# Altium schematic sheet 101_GridPosMainHub.SchDoc: Grid Position Main Hub
size A2; Organization: Greenfield Tech Solutions; Address1: Molendreef 33; Address2: Ossendrecht; Address3: 4641CS; Address4: The Netherlands; SheetNumber: 2; SheetTotal: 4
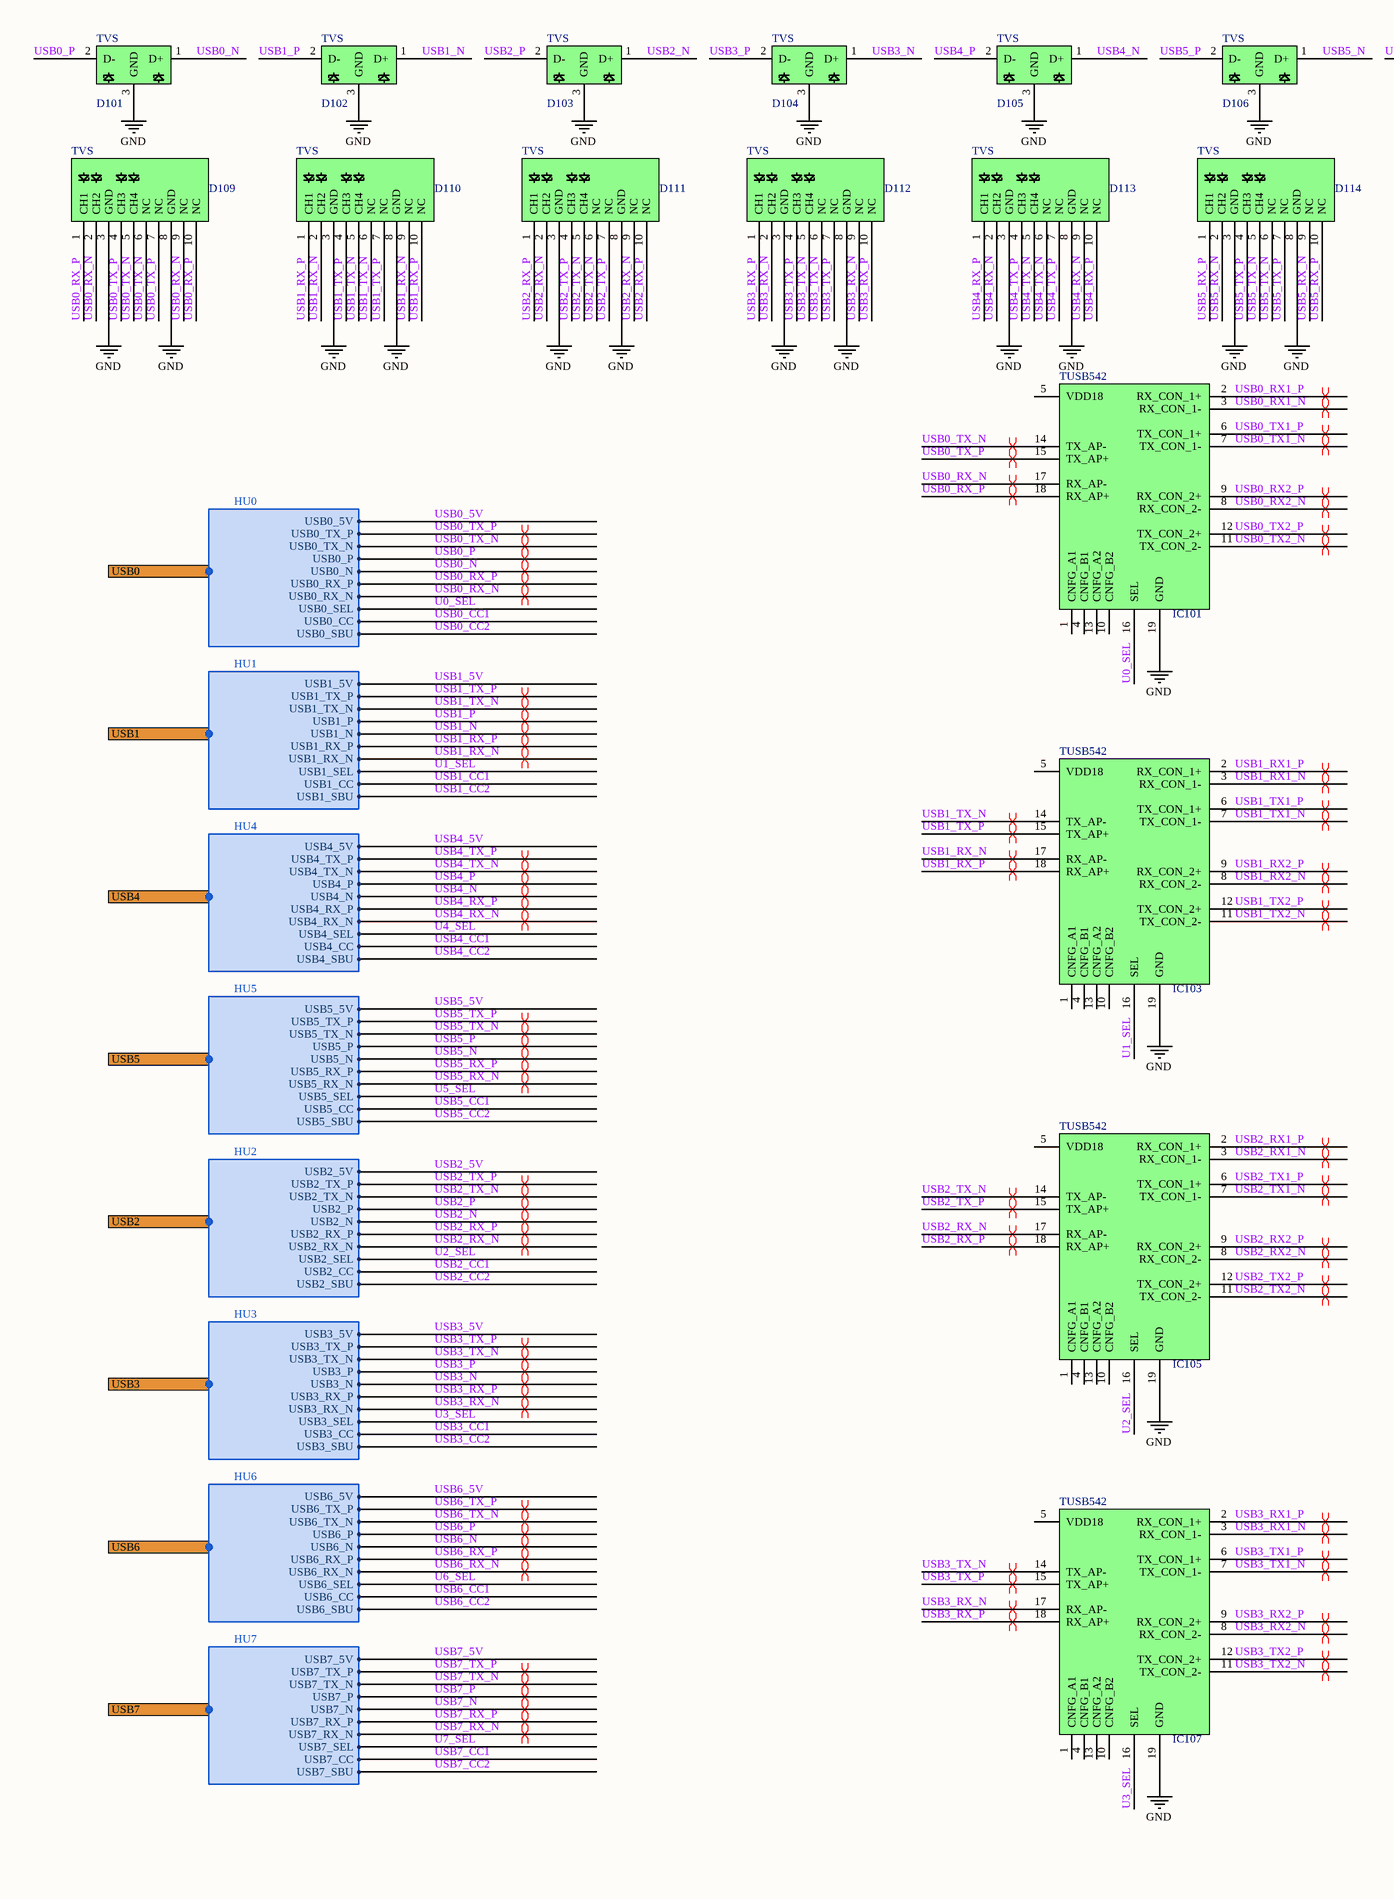
[diagram p0: 101_GridPosMainHub.SchDoc, left]
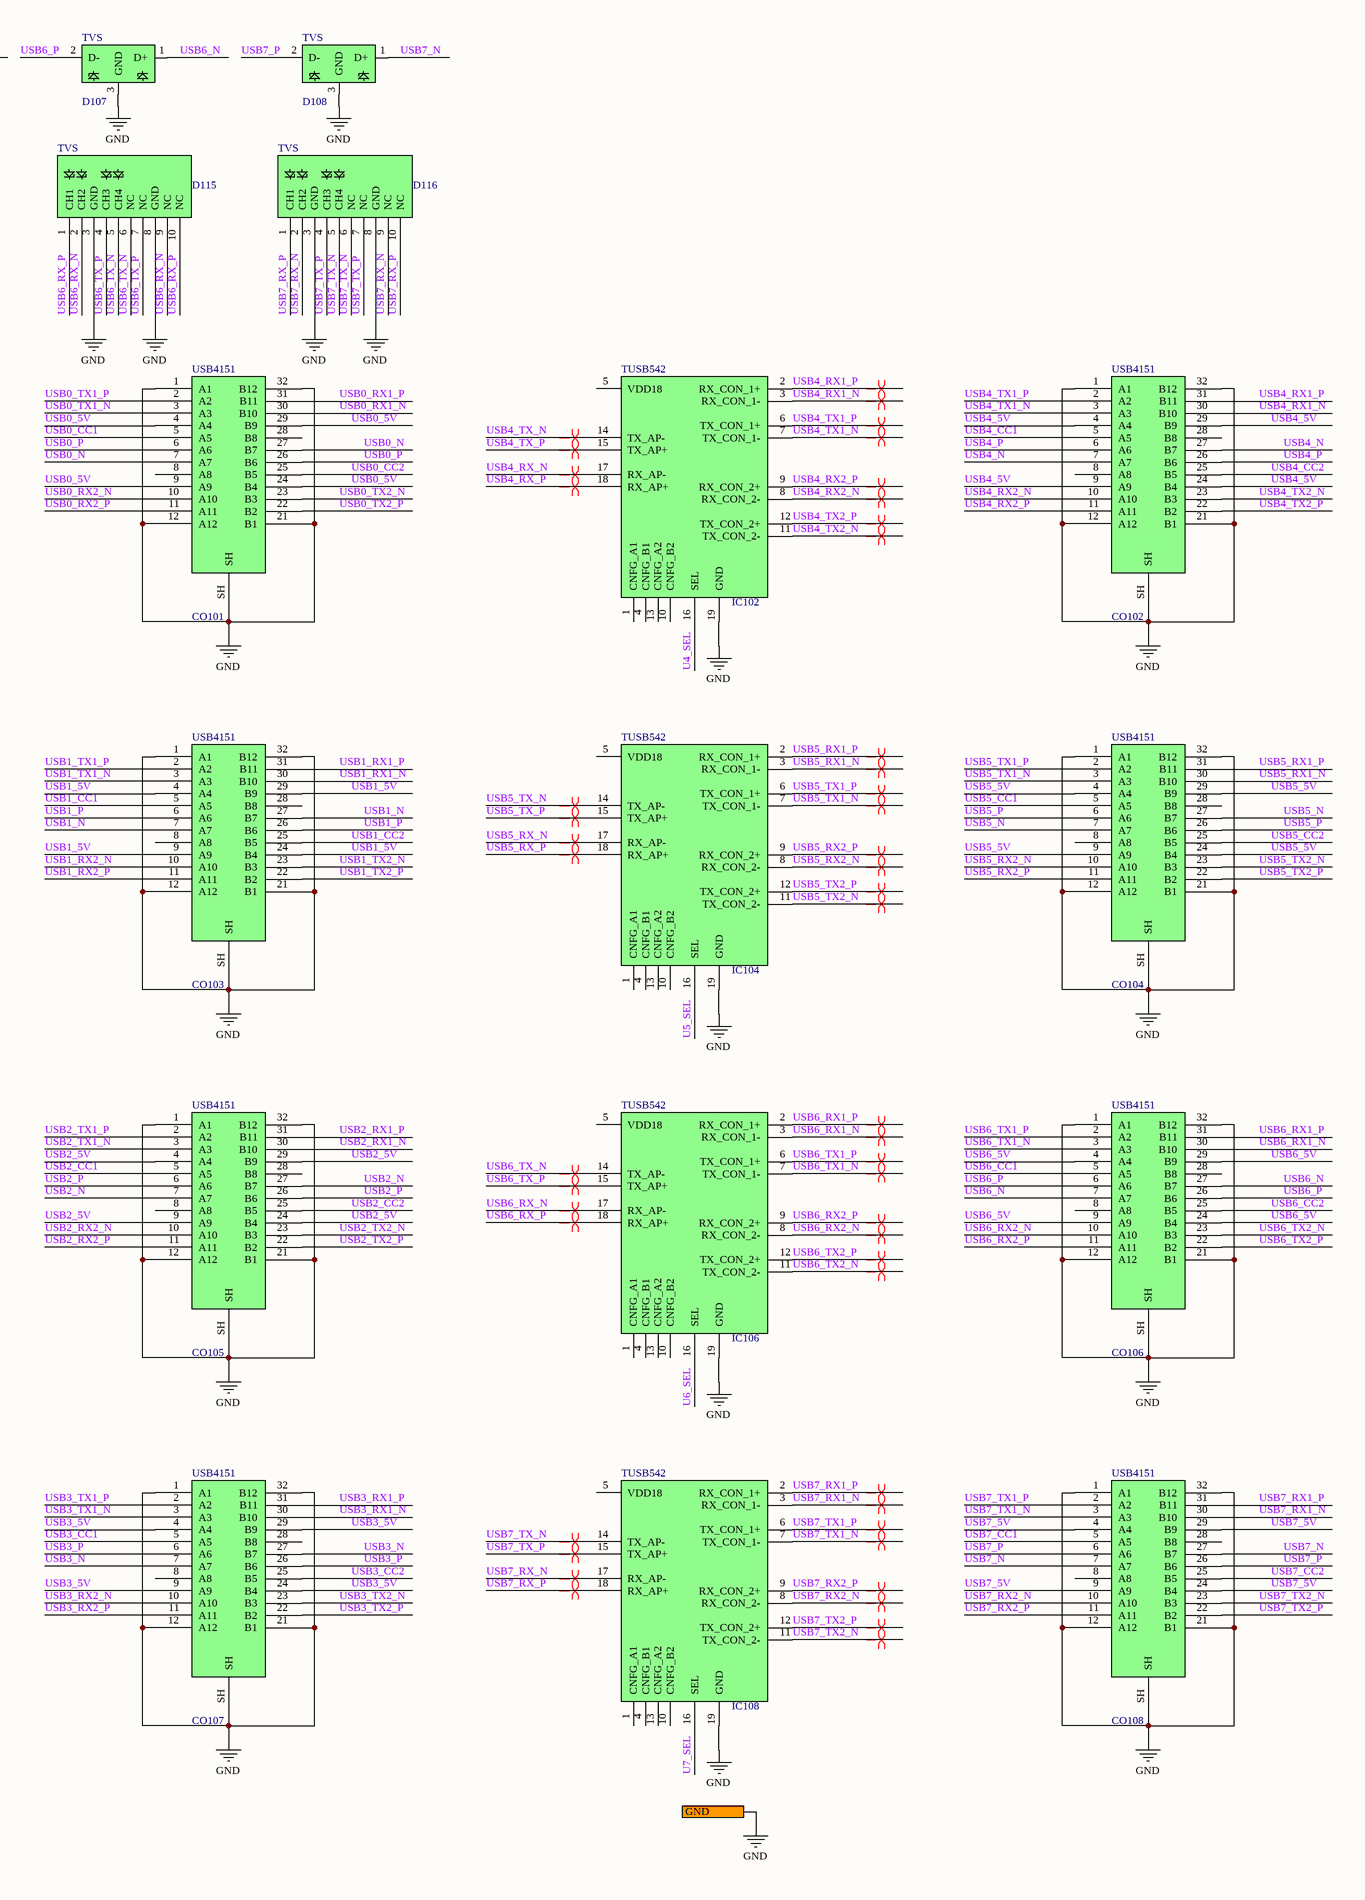
[diagram p1: 101_GridPosMainHub.SchDoc, right]

## Parts
CO101  USB4151  [USB4151-GF-C]
CO102  USB4151  [USB4151-GF-C]
CO103  USB4151  [USB4151-GF-C]
CO104  USB4151  [USB4151-GF-C]
CO105  USB4151  [USB4151-GF-C]
CO106  USB4151  [USB4151-GF-C]
CO107  USB4151  [USB4151-GF-C]
CO108  USB4151  [USB4151-GF-C]
D101  TVS  [SOT-3]
D102  TVS  [SOT-3]
D103  TVS  [SOT-3]
D104  TVS  [SOT-3]
D105  TVS  [SOT-3]
D106  TVS  [SOT-3]
D107  TVS  [SOT-3]
D108  TVS  [SOT-3]
D109  TVS  [SOT-1176-1]
D110  TVS  [SOT-1176-1]
D111  TVS  [SOT-1176-1]
D112  TVS  [SOT-1176-1]
D113  TVS  [SOT-1176-1]
D114  TVS  [SOT-1176-1]
D115  TVS  [SOT-1176-1]
D116  TVS  [SOT-1176-1]
IC101  TUSB542  [X2QFN-18]
IC102  TUSB542  [X2QFN-18]
IC103  TUSB542  [X2QFN-18]
IC104  TUSB542  [X2QFN-18]
IC105  TUSB542  [X2QFN-18]
IC106  TUSB542  [X2QFN-18]
IC107  TUSB542  [X2QFN-18]
IC108  TUSB542  [X2QFN-18]

## Ports
GND, USB0 (harness HU0), USB1 (harness HU1), USB2 (harness HU2), USB3 (harness HU3), USB4 (harness HU4), USB5 (harness HU5), USB6 (harness HU6), USB7 (harness HU7)

## Harnesses
HU0: USB0_5V, USB0_TX_P, USB0_TX_N, USB0_N, USB0_RX_P, USB0_RX_N, USB0_SEL, USB0_P, USB0_CC, USB0_SBU
HU5: USB5_5V, USB5_TX_P, USB5_TX_N, USB5_N, USB5_RX_P, USB5_RX_N, USB5_SEL, USB5_P, USB5_CC, USB5_SBU
HU4: USB4_5V, USB4_TX_P, USB4_TX_N, USB4_N, USB4_RX_P, USB4_RX_N, USB4_SEL, USB4_P, USB4_CC, USB4_SBU
HU1: USB1_5V, USB1_TX_P, USB1_TX_N, USB1_N, USB1_RX_P, USB1_RX_N, USB1_SEL, USB1_P, USB1_CC, USB1_SBU
HU7: USB7_5V, USB7_TX_P, USB7_TX_N, USB7_N, USB7_RX_P, USB7_RX_N, USB7_SEL, USB7_P, USB7_CC, USB7_SBU
HU6: USB6_5V, USB6_TX_P, USB6_TX_N, USB6_N, USB6_RX_P, USB6_RX_N, USB6_SEL, USB6_P, USB6_CC, USB6_SBU
HU3: USB3_5V, USB3_TX_P, USB3_TX_N, USB3_N, USB3_RX_P, USB3_RX_N, USB3_SEL, USB3_P, USB3_CC, USB3_SBU
HU2: USB2_5V, USB2_TX_P, USB2_TX_N, USB2_N, USB2_RX_P, USB2_RX_N, USB2_SEL, USB2_P, USB2_CC, USB2_SBU

## Nets
GND: CO101.1(A1) CO101.12(A12) CO101.21(B1) CO101.32(B12) CO101.SH CO102.1(A1) CO102.12(A12) CO102.21(B1) CO102.32(B12) CO102.SH CO103.1(A1) CO103.12(A12) CO103.21(B1) CO103.32(B12) CO103.SH CO104.1(A1) CO104.12(A12) CO104.21(B1) CO104.32(B12) CO104.SH CO105.1(A1) CO105.12(A12) CO105.21(B1) CO105.32(B12) CO105.SH CO106.1(A1) CO106.12(A12) CO106.21(B1) CO106.32(B12) CO106.SH CO107.1(A1) CO107.12(A12) CO107.21(B1) CO107.32(B12) CO107.SH CO108.1(A1) CO108.12(A12) CO108.21(B1) CO108.32(B12) CO108.SH D101.3(GND) D102.3(GND) D103.3(GND) D104.3(GND) D105.3(GND) D106.3(GND) D107.3(GND) D108.3(GND) D109.3(GND) D109.8(GND) D110.3(GND) D110.8(GND) D111.3(GND) D111.8(GND) D112.3(GND) D112.8(GND) D113.3(GND) D113.8(GND) D114.3(GND) D114.8(GND) D115.3(GND) D115.8(GND) D116.3(GND) D116.8(GND) IC101.19(GND) IC102.19(GND) IC103.19(GND) IC104.19(GND) IC105.19(GND) IC106.19(GND) IC107.19(GND) IC108.19(GND) ; port GND
U0_SEL: IC101.16(SEL) ; port USB0.USB0_SEL
U1_SEL: IC103.16(SEL) ; port USB1.USB1_SEL
U2_SEL: IC105.16(SEL) ; port USB2.USB2_SEL
U3_SEL: IC107.16(SEL) ; port USB3.USB3_SEL
U4_SEL: IC102.16(SEL) ; port USB4.USB4_SEL
U5_SEL: IC104.16(SEL) ; port USB5.USB5_SEL
U6_SEL: IC106.16(SEL) ; port USB6.USB6_SEL
U7_SEL: IC108.16(SEL) ; port USB7.USB7_SEL
USB0_5V: CO101.4(A4) CO101.9(A9) CO101.24(B4) CO101.29(B9) ; port USB0.USB0_5V
USB0_CC1: CO101.5(A5) ; port USB0.USB0_CC
USB0_CC2: CO101.25(B5) ; port USB0.USB0_SBU
USB0_N: CO101.7(A7) CO101.27(B7) D101.1(D+) ; port USB0.USB0_N
USB0_P: CO101.6(A6) CO101.26(B6) D101.2(D-) ; port USB0.USB0_P
USB0_RX1_N: CO101.30(B10) IC101.3(RX_CON_1-)
USB0_RX1_P: CO101.31(B11) IC101.2(RX_CON_1+)
USB0_RX2_N: CO101.10(A10) IC101.8(RX_CON_2-)
USB0_RX2_P: CO101.11(A11) IC101.9(RX_CON_2+)
USB0_RX_N: D109.2(CH2) D109.9(NC) IC101.17(RX_AP-) ; port USB0.USB0_RX_N
USB0_RX_P: D109.1(CH1) D109.10(NC) IC101.18(RX_AP+) ; port USB0.USB0_RX_P
USB0_TX1_N: CO101.3(A3) IC101.7(TX_CON_1-)
USB0_TX1_P: CO101.2(A2) IC101.6(TX_CON_1+)
USB0_TX2_N: CO101.23(B3) IC101.11(TX_CON_2-)
USB0_TX2_P: CO101.22(B2) IC101.12(TX_CON_2+)
USB0_TX_N: D109.5(CH4) D109.6(NC) IC101.14(TX_AP-) ; port USB0.USB0_TX_N
USB0_TX_P: D109.4(CH3) D109.7(NC) IC101.15(TX_AP+) ; port USB0.USB0_TX_P
USB1_5V: CO103.4(A4) CO103.9(A9) CO103.24(B4) CO103.29(B9) ; port USB1.USB1_5V
USB1_CC1: CO103.5(A5) ; port USB1.USB1_CC
USB1_CC2: CO103.25(B5) ; port USB1.USB1_SBU
USB1_N: CO103.7(A7) CO103.27(B7) D102.1(D+) ; port USB1.USB1_N
USB1_P: CO103.6(A6) CO103.26(B6) D102.2(D-) ; port USB1.USB1_P
USB1_RX1_N: CO103.30(B10) IC103.3(RX_CON_1-)
USB1_RX1_P: CO103.31(B11) IC103.2(RX_CON_1+)
USB1_RX2_N: CO103.10(A10) IC103.8(RX_CON_2-)
USB1_RX2_P: CO103.11(A11) IC103.9(RX_CON_2+)
USB1_RX_N: D110.2(CH2) D110.9(NC) IC103.17(RX_AP-) ; port USB1.USB1_RX_N
USB1_RX_P: D110.1(CH1) D110.10(NC) IC103.18(RX_AP+) ; port USB1.USB1_RX_P
USB1_TX1_N: CO103.3(A3) IC103.7(TX_CON_1-)
USB1_TX1_P: CO103.2(A2) IC103.6(TX_CON_1+)
USB1_TX2_N: CO103.23(B3) IC103.11(TX_CON_2-)
USB1_TX2_P: CO103.22(B2) IC103.12(TX_CON_2+)
USB1_TX_N: D110.5(CH4) D110.6(NC) IC103.14(TX_AP-) ; port USB1.USB1_TX_N
USB1_TX_P: D110.4(CH3) D110.7(NC) IC103.15(TX_AP+) ; port USB1.USB1_TX_P
USB2_5V: CO105.4(A4) CO105.9(A9) CO105.24(B4) CO105.29(B9) ; port USB2.USB2_5V
USB2_CC1: CO105.5(A5) ; port USB2.USB2_CC
USB2_CC2: CO105.25(B5) ; port USB2.USB2_SBU
USB2_N: CO105.7(A7) CO105.27(B7) D103.1(D+) ; port USB2.USB2_N
USB2_P: CO105.6(A6) CO105.26(B6) D103.2(D-) ; port USB2.USB2_P
USB2_RX1_N: CO105.30(B10) IC105.3(RX_CON_1-)
USB2_RX1_P: CO105.31(B11) IC105.2(RX_CON_1+)
USB2_RX2_N: CO105.10(A10) IC105.8(RX_CON_2-)
USB2_RX2_P: CO105.11(A11) IC105.9(RX_CON_2+)
USB2_RX_N: D111.2(CH2) D111.9(NC) IC105.17(RX_AP-) ; port USB2.USB2_RX_N
USB2_RX_P: D111.1(CH1) D111.10(NC) IC105.18(RX_AP+) ; port USB2.USB2_RX_P
USB2_TX1_N: CO105.3(A3) IC105.7(TX_CON_1-)
USB2_TX1_P: CO105.2(A2) IC105.6(TX_CON_1+)
USB2_TX2_N: CO105.23(B3) IC105.11(TX_CON_2-)
USB2_TX2_P: CO105.22(B2) IC105.12(TX_CON_2+)
USB2_TX_N: D111.5(CH4) D111.6(NC) IC105.14(TX_AP-) ; port USB2.USB2_TX_N
USB2_TX_P: D111.4(CH3) D111.7(NC) IC105.15(TX_AP+) ; port USB2.USB2_TX_P
USB3_5V: CO107.4(A4) CO107.9(A9) CO107.24(B4) CO107.29(B9) ; port USB3.USB3_5V
USB3_CC1: CO107.5(A5) ; port USB3.USB3_CC
USB3_CC2: CO107.25(B5) ; port USB3.USB3_SBU
USB3_N: CO107.7(A7) CO107.27(B7) D104.1(D+) ; port USB3.USB3_N
USB3_P: CO107.6(A6) CO107.26(B6) D104.2(D-) ; port USB3.USB3_P
USB3_RX1_N: CO107.30(B10) IC107.3(RX_CON_1-)
USB3_RX1_P: CO107.31(B11) IC107.2(RX_CON_1+)
USB3_RX2_N: CO107.10(A10) IC107.8(RX_CON_2-)
USB3_RX2_P: CO107.11(A11) IC107.9(RX_CON_2+)
USB3_RX_N: D112.2(CH2) D112.9(NC) IC107.17(RX_AP-) ; port USB3.USB3_RX_N
USB3_RX_P: D112.1(CH1) D112.10(NC) IC107.18(RX_AP+) ; port USB3.USB3_RX_P
USB3_TX1_N: CO107.3(A3) IC107.7(TX_CON_1-)
USB3_TX1_P: CO107.2(A2) IC107.6(TX_CON_1+)
USB3_TX2_N: CO107.23(B3) IC107.11(TX_CON_2-)
USB3_TX2_P: CO107.22(B2) IC107.12(TX_CON_2+)
USB3_TX_N: D112.5(CH4) D112.6(NC) IC107.14(TX_AP-) ; port USB3.USB3_TX_N
USB3_TX_P: D112.4(CH3) D112.7(NC) IC107.15(TX_AP+) ; port USB3.USB3_TX_P
USB4_5V: CO102.4(A4) CO102.9(A9) CO102.24(B4) CO102.29(B9) ; port USB4.USB4_5V
USB4_CC1: CO102.5(A5) ; port USB4.USB4_CC
USB4_CC2: CO102.25(B5) ; port USB4.USB4_SBU
USB4_N: CO102.7(A7) CO102.27(B7) D105.1(D+) ; port USB4.USB4_N
USB4_P: CO102.6(A6) CO102.26(B6) D105.2(D-) ; port USB4.USB4_P
USB4_RX1_N: CO102.30(B10) IC102.3(RX_CON_1-)
USB4_RX1_P: CO102.31(B11) IC102.2(RX_CON_1+)
USB4_RX2_N: CO102.10(A10) IC102.8(RX_CON_2-)
USB4_RX2_P: CO102.11(A11) IC102.9(RX_CON_2+)
USB4_RX_N: D113.2(CH2) D113.9(NC) IC102.17(RX_AP-) ; port USB4.USB4_RX_N
USB4_RX_P: D113.1(CH1) D113.10(NC) IC102.18(RX_AP+) ; port USB4.USB4_RX_P
USB4_TX1_N: CO102.3(A3) IC102.7(TX_CON_1-)
USB4_TX1_P: CO102.2(A2) IC102.6(TX_CON_1+)
USB4_TX2_N: CO102.23(B3) IC102.11(TX_CON_2-)
USB4_TX2_P: CO102.22(B2) IC102.12(TX_CON_2+)
USB4_TX_N: D113.5(CH4) D113.6(NC) IC102.14(TX_AP-) ; port USB4.USB4_TX_N
USB4_TX_P: D113.4(CH3) D113.7(NC) IC102.15(TX_AP+) ; port USB4.USB4_TX_P
USB5_5V: CO104.4(A4) CO104.9(A9) CO104.24(B4) CO104.29(B9) ; port USB5.USB5_5V
USB5_CC1: CO104.5(A5) ; port USB5.USB5_CC
USB5_CC2: CO104.25(B5) ; port USB5.USB5_SBU
USB5_N: CO104.7(A7) CO104.27(B7) D106.1(D+) ; port USB5.USB5_N
USB5_P: CO104.6(A6) CO104.26(B6) D106.2(D-) ; port USB5.USB5_P
USB5_RX1_N: CO104.30(B10) IC104.3(RX_CON_1-)
USB5_RX1_P: CO104.31(B11) IC104.2(RX_CON_1+)
USB5_RX2_N: CO104.10(A10) IC104.8(RX_CON_2-)
USB5_RX2_P: CO104.11(A11) IC104.9(RX_CON_2+)
USB5_RX_N: D114.2(CH2) D114.9(NC) IC104.17(RX_AP-) ; port USB5.USB5_RX_N
USB5_RX_P: D114.1(CH1) D114.10(NC) IC104.18(RX_AP+) ; port USB5.USB5_RX_P
USB5_TX1_N: CO104.3(A3) IC104.7(TX_CON_1-)
USB5_TX1_P: CO104.2(A2) IC104.6(TX_CON_1+)
USB5_TX2_N: CO104.23(B3) IC104.11(TX_CON_2-)
USB5_TX2_P: CO104.22(B2) IC104.12(TX_CON_2+)
USB5_TX_N: D114.5(CH4) D114.6(NC) IC104.14(TX_AP-) ; port USB5.USB5_TX_N
USB5_TX_P: D114.4(CH3) D114.7(NC) IC104.15(TX_AP+) ; port USB5.USB5_TX_P
USB6_5V: CO106.4(A4) CO106.9(A9) CO106.24(B4) CO106.29(B9) ; port USB6.USB6_5V
USB6_CC1: CO106.5(A5) ; port USB6.USB6_CC
USB6_CC2: CO106.25(B5) ; port USB6.USB6_SBU
USB6_N: CO106.7(A7) CO106.27(B7) D107.1(D+) ; port USB6.USB6_N
USB6_P: CO106.6(A6) CO106.26(B6) D107.2(D-) ; port USB6.USB6_P
USB6_RX1_N: CO106.30(B10) IC106.3(RX_CON_1-)
USB6_RX1_P: CO106.31(B11) IC106.2(RX_CON_1+)
USB6_RX2_N: CO106.10(A10) IC106.8(RX_CON_2-)
USB6_RX2_P: CO106.11(A11) IC106.9(RX_CON_2+)
USB6_RX_N: D115.2(CH2) D115.9(NC) IC106.17(RX_AP-) ; port USB6.USB6_RX_N
USB6_RX_P: D115.1(CH1) D115.10(NC) IC106.18(RX_AP+) ; port USB6.USB6_RX_P
USB6_TX1_N: CO106.3(A3) IC106.7(TX_CON_1-)
USB6_TX1_P: CO106.2(A2) IC106.6(TX_CON_1+)
USB6_TX2_N: CO106.23(B3) IC106.11(TX_CON_2-)
USB6_TX2_P: CO106.22(B2) IC106.12(TX_CON_2+)
USB6_TX_N: D115.5(CH4) D115.6(NC) IC106.14(TX_AP-) ; port USB6.USB6_TX_N
USB6_TX_P: D115.4(CH3) D115.7(NC) IC106.15(TX_AP+) ; port USB6.USB6_TX_P
USB7_5V: CO108.4(A4) CO108.9(A9) CO108.24(B4) CO108.29(B9) ; port USB7.USB7_5V
USB7_CC1: CO108.5(A5) ; port USB7.USB7_CC
USB7_CC2: CO108.25(B5) ; port USB7.USB7_SBU
USB7_N: CO108.7(A7) CO108.27(B7) D108.1(D+) ; port USB7.USB7_N
USB7_P: CO108.6(A6) CO108.26(B6) D108.2(D-) ; port USB7.USB7_P
USB7_RX1_N: CO108.30(B10) IC108.3(RX_CON_1-)
USB7_RX1_P: CO108.31(B11) IC108.2(RX_CON_1+)
USB7_RX2_N: CO108.10(A10) IC108.8(RX_CON_2-)
USB7_RX2_P: CO108.11(A11) IC108.9(RX_CON_2+)
USB7_RX_N: D116.2(CH2) D116.9(NC) IC108.17(RX_AP-) ; port USB7.USB7_RX_N
USB7_RX_P: D116.1(CH1) D116.10(NC) IC108.18(RX_AP+) ; port USB7.USB7_RX_P
USB7_TX1_N: CO108.3(A3) IC108.7(TX_CON_1-)
USB7_TX1_P: CO108.2(A2) IC108.6(TX_CON_1+)
USB7_TX2_N: CO108.23(B3) IC108.11(TX_CON_2-)
USB7_TX2_P: CO108.22(B2) IC108.12(TX_CON_2+)
USB7_TX_N: D116.5(CH4) D116.6(NC) IC108.14(TX_AP-) ; port USB7.USB7_TX_N
USB7_TX_P: D116.4(CH3) D116.7(NC) IC108.15(TX_AP+) ; port USB7.USB7_TX_P

Not connected (* = marked no-connect by the designer): CO101 8(A8) 28(B8); CO102 8(A8) 28(B8); CO103 8(A8) 28(B8); CO104 8(A8) 28(B8); CO105 8(A8) 28(B8); CO106 8(A8) 28(B8); CO107 8(A8) 28(B8); CO108 8(A8) 28(B8); IC101 1(CNFG_A1) 4(CNFG_B1) 5(VDD18) 10(CNFG_B2) 13(CNFG_A2); IC102 1(CNFG_A1) 4(CNFG_B1) 5(VDD18) 10(CNFG_B2) 13(CNFG_A2); IC103 1(CNFG_A1) 4(CNFG_B1) 5(VDD18) 10(CNFG_B2) 13(CNFG_A2); IC104 1(CNFG_A1) 4(CNFG_B1) 5(VDD18) 10(CNFG_B2) 13(CNFG_A2); IC105 1(CNFG_A1) 4(CNFG_B1) 5(VDD18) 10(CNFG_B2) 13(CNFG_A2); IC106 1(CNFG_A1) 4(CNFG_B1) 5(VDD18) 10(CNFG_B2) 13(CNFG_A2); IC107 1(CNFG_A1) 4(CNFG_B1) 5(VDD18) 10(CNFG_B2) 13(CNFG_A2); IC108 1(CNFG_A1) 4(CNFG_B1) 5(VDD18) 10(CNFG_B2) 13(CNFG_A2)

## Layout directives
differential pair; differential pair class USB3: USB0_N, USB0_P, USB0_RX1_N, USB0_RX1_P, USB0_RX2_N, USB0_RX2_P, USB0_RX_N, USB0_RX_P, USB0_TX1_N, USB0_TX1_P, USB0_TX2_N, USB0_TX2_P, USB0_TX_N, USB0_TX_P, USB1_N, USB1_P, USB1_RX1_N, USB1_RX1_P, USB1_RX2_N, USB1_RX2_P, USB1_RX_N, USB1_RX_P, USB1_TX1_N, USB1_TX1_P, USB1_TX2_N, USB1_TX2_P, USB1_TX_N, USB1_TX_P, USB2_N, USB2_P, USB2_RX1_N, USB2_RX1_P, USB2_RX2_N, USB2_RX2_P, USB2_RX_N, USB2_RX_P, USB2_TX1_N, USB2_TX1_P, USB2_TX2_N, USB2_TX2_P, USB2_TX_N, USB2_TX_P, USB3_N, USB3_P, USB3_RX1_N, USB3_RX1_P, USB3_RX2_N, USB3_RX2_P, USB3_RX_N, USB3_RX_P, USB3_TX1_N, USB3_TX1_P, USB3_TX2_N, USB3_TX2_P, USB3_TX_N, USB3_TX_P, USB4_N, USB4_P, USB4_RX1_N, USB4_RX1_P, USB4_RX2_N, USB4_RX2_P, USB4_RX_N, USB4_RX_P, USB4_TX1_N, USB4_TX1_P, USB4_TX2_N, USB4_TX2_P, USB4_TX_N, USB4_TX_P, USB5_N, USB5_P, USB5_RX1_N, USB5_RX1_P, USB5_RX2_N, USB5_RX2_P, USB5_RX_N, USB5_RX_P, USB5_TX1_N, USB5_TX1_P, USB5_TX2_N, USB5_TX2_P, USB5_TX_N, USB5_TX_P, USB6_N, USB6_P, USB6_RX1_N, USB6_RX1_P, USB6_RX2_N, USB6_RX2_P, USB6_RX_N, USB6_RX_P, USB6_TX1_N, USB6_TX1_P, USB6_TX2_N, USB6_TX2_P, USB6_TX_N, USB6_TX_P, USB7_N, USB7_P, USB7_RX1_N, USB7_RX1_P, USB7_RX2_N, USB7_RX2_P, USB7_RX_N, USB7_RX_P, USB7_TX1_N, USB7_TX1_P, USB7_TX2_N, USB7_TX2_P, USB7_TX_N, USB7_TX_P

## Notes on the sheet
- Title
- Size:
- Date:
- File:
- A2
- Number:
- Time:
- Revision:
- Sheet
- of

## Library data of the parts
CO101-CO108 = CO0017: USB C connector Plug Vertical; Part Number: CO0017; ID: 26; RefVal: USB4151; ManfactPart: USB4151-GF-C
D101-D108 = DI0002: USB 2 TVS Diode; Part Number: DI0002; ManfactPart: TPD2EUSB30DRTR; ID: 2; RefVal: TVS
D109-D116 = DI0007: USB 3 TVS Diode; Part Number: DI0007; ManfactPart: PUSB3FA2Z; ID: 7; RefVal: TVS
IC101-IC108 = IC0039: TUSB542 USB Type-C 5 Gbps Redriver 2:1 MUX; Part Number: IC0039; ID: 39; RefVal: TUSB542; ManfactPart: TUSB542